# Altium schematic sheet DIGITAL.SchDoc
size B; SheetNumber: 1; SheetTotal: 3
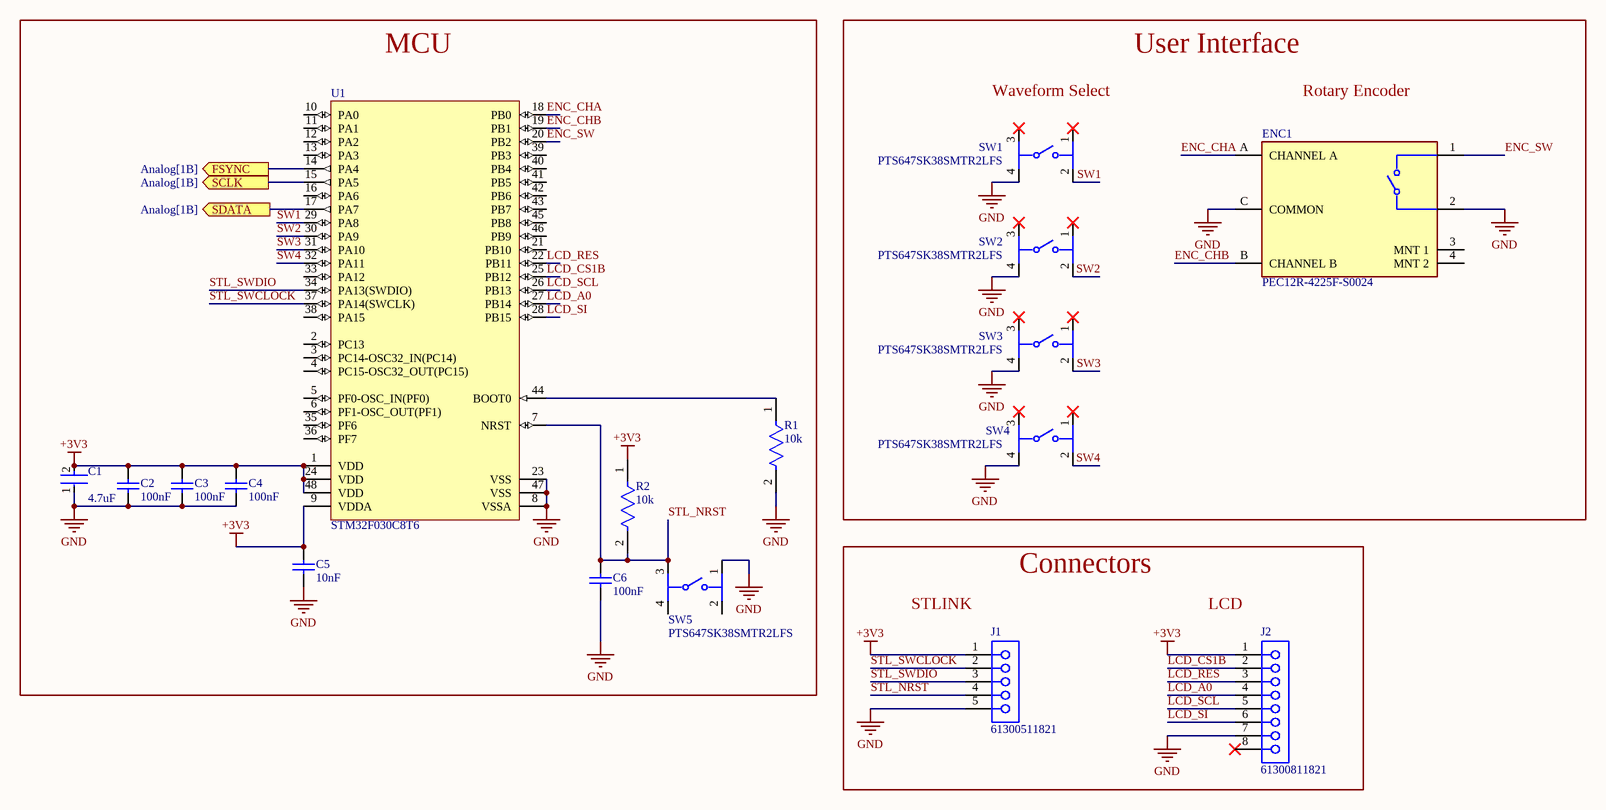
[diagram p0: DIGITAL.SchDoc]

## Parts
C1  4.7uF  [FP-GRM219-0_15-0_1-IPC_B]
C2  100nF  [CAPC1608X87X45LL20T05]
C3  100nF  [CAPC1608X87X45LL20T05]
C4  100nF  [CAPC1608X87X45LL20T05]
C5  10nF  [CAPC1206(3216)150_L]
C6  100nF  [CAPC1608X87X45LL20T05]
ENC1  PEC12R-4225F-S0024  [FP-PEC12R-4225F-S0024-MFG]
J1  61300511821  [61300511821]
J2  61300811821  [61300811821]
R1  10k  [FP-TFCR0402-IPC_B]
R2  10k  [FP-TFCR0402-IPC_B]
SW1  PTS647SK38SMTR2LFS  [FP-PTS647SK38SMTR2LFS-MFG]
SW2  PTS647SK38SMTR2LFS  [FP-PTS647SK38SMTR2LFS-MFG]
SW3  PTS647SK38SMTR2LFS  [FP-PTS647SK38SMTR2LFS-MFG]
SW4  PTS647SK38SMTR2LFS  [FP-PTS647SK38SMTR2LFS-MFG]
SW5  PTS647SK38SMTR2LFS  [FP-PTS647SK38SMTR2LFS-MFG]
U1  STM32F030C8T6  [STM-LQFP48_M]

## Blocks framed on the sheet
MCU: C1-C6 R1 R2 SW5 U1
User Interface: ENC1 SW1-SW4
Connectors: J1 J2

## Ports
FSYNC (out, see Analog[1B]), SCLK (out, see Analog[1B]), SDATA (out, see Analog[1B])

## Nets
+3V3: C1.2 C2.2 C3.2 C4.2 C5.2 J1.1 J2.1 R2.1 U1.1(VDD) U1.9(VDDA) U1.24(VDD) U1.48(VDD)
GND: C1.1 C2.1 C3.1 C4.1 C5.1 C6.1 ENC1.2 ENC1.C(COMMON) J1.5 J2.7 R1.2 SW1.4 SW2.4 SW3.4 SW4.4 SW5.1 U1.8(VSSA) U1.23(VSS) U1.47(VSS)
ENC_CHA: ENC1.A(CHANNEL_A) U1.18(PB0)
ENC_CHB: ENC1.B(CHANNEL_B) U1.19(PB1)
ENC_SW: ENC1.1 U1.20(PB2)
FSYNC: U1.14(PA4) ; port FSYNC
LCD_A0: J2.4 U1.27(PB14)
LCD_CS1B: J2.2 U1.25(PB12)
LCD_RES: J2.3 U1.22(PB11)
LCD_SCL: J2.5 U1.26(PB13)
LCD_SI: J2.6 U1.28(PB15)
SCLK: U1.15(PA5) ; port SCLK
SDATA: U1.17(PA7) ; port SDATA
STL_NRST: C6.2 J1.4 R2.2 SW5.3 U1.7(NRST)
STL_SWCLOCK: J1.2 U1.37(PA14(SWCLK))
STL_SWDIO: J1.3 U1.34(PA13(SWDIO))
SW1: SW1.2 U1.29(PA8)
SW2: SW2.2 U1.30(PA9)
SW3: SW3.2 U1.31(PA10)
SW4: SW4.2 U1.32(PA11)
NetR1_1: R1.1 U1.44(BOOT0)

Not connected (* = marked no-connect by the designer): ENC1 3(MNT_1) 4(MNT_2); J2 8*; SW1 1* 3*; SW2 1* 3*; SW3 1* 3*; SW4 1* 3*; SW5 2 4; U1 2(PC13) 3(PC14-OSC32_IN(PC14)) 4(PC15-OSC32_OUT(PC15)) 5(PF0-OSC_IN(PF0)) 6(PF1-OSC_OUT(PF1)) 10(PA0) 11(PA1) 12(PA2) 13(PA3) 16(PA6) 21(PB10) 33(PA12) 35(PF6) 36(PF7) 38(PA15) 39(PB3) 40(PB4) 41(PB5) 42(PB6) 43(PB7) 45(PB8) 46(PB9)

## Notes on the sheet
- Waveform Select
- Rotary Encoder
- (near J1) STLINK
- (near J2) LCD

## Library data of the parts
C1 = CMP-06035-028467-1: Chip Multilayer Ceramic Capacitors for General Purpose, 0805, 4.7uF, X5R, 15%, 20%, 25V
C2-C4 C6 = CMP-2006-00001-1: Ceramic 100nF X7R 16V 5%; Part Number: C0603X104J4RACTU; Manufacturer: Kemet
C5 = CMP-1037-03452-1: CAP 10nF 10V ±5% 1206 (3216 Metric) Thickness 1.45mm SMD; Tolerance: Â±5%; Case-Metric: 3216; Case-EIA: 1206; Max Thickness: 1.45 mm; Technology: SMT; Value: 10nF; Rated Voltage: 10 V
ENC1 = CMP-07421-000041-1: ROTARY ENCODER MECHANICAL 24PPR; Built in Switch: Yes; Hole Diameter: 1mm; Number of Channels: 2; Pulses per Revolution: 24; Output Type: Quadrature; Height: 13.4mm; Mount: Through Hole; RoHS Compliant: Yes; Orientation: Vertical; Length: 13.4mm; Encoder Type: Mechanical; Termination: PC Pin; Series: PEC12R; Min Operating Temperature: -30°C; Detent: Yes; REACH SVHC: No SVHC; Package Quantity: 75; Max Operating Temperature: 70°C; Packaging: Bulk; Width: 12.5mm
J1 = CMP-1502-01320-3: NexarPartId: 61924716; Current Rating: 3A; Operating Supply Voltage: 250V; Gender: Female; Contact Resistance: 20mΩ; Lead Pitch: 2.54mm; Orientation: Vertical; RoHS: Non-Compliant; Number of Pins: 5
J2 = CMP-1502-01327-3: NexarPartId: 61924723; Current Rating: 3A; Gender: Female; Contact Resistance: 20mΩ; Operating Supply Voltage: 250V; Lead Pitch: 2.54mm; RoHS: Non-Compliant; Orientation: Vertical; Number of Pins: 8
R1 R2 = CMP-250906-167145-1: RES Thin Film,  10kΩ, 0.1%, 0.063W, 50ppm/°C, 0402
SW1-SW5 = CMP-10040-000033-1: TACT 4.5 X 4.5, 3.8 MM H, 2.5N,; Switch Function: Off-Mom; Switch Travel: 0.25mm; Actuator Type: Standard; Illumination Type: Non-Illuminated; Mechanical Life: 100000Cycles; Ratings: IP40; Operating Force: 250gf; Throw Configuration: SPST; Max Operating Temperature: 70°C; Min Operating Temperature: -20°C; Termination: Gull Wing; Mount: Surface Mount; Packaging: Tape and Reel
U1 = CMP-0304-00064-2: ARM Cortex-M0 32-bit MCU, 64 KB Flash, 8 KB Internal RAM, 39 I/Os, 48-Pin LQFP, -40 to 85 degC, Tape and Reel; Manufacturer: STMicroelectronics; PartNumber: STM32F030C8T6TR; Supply Voltage(Vcc) min (V): 2.4; I/Os (High Current): 39; Operating Frequency(F) (Processor speed) (MHz): 48; FLASH Size (Prog) (kB): 64; Internal RAM Size (kB): 8; Mounting Technology: Surface Mount; ComponentLink1Description: Manufacturer URL; Core: ARM Cortex-M0; ComponentLink1URL: http://www.st.com/; Package Description: 48-Pin Low Profile Quad Flat Package, Body 7 x 7 mm, Pitch 0.5 mm; Packing: Tape and Reel; DatasheetVersion: Rev. 2; ComponentLink2URL: http://www.st.com/st-web-ui/static/active/en/resource/technical/document/datasheet/DM00088500.pdf; ComponentLink2Description: Datasheet; Package Reference: LQFP48